# EAGLE design Modul I2C (EAGLE 9.0.1)
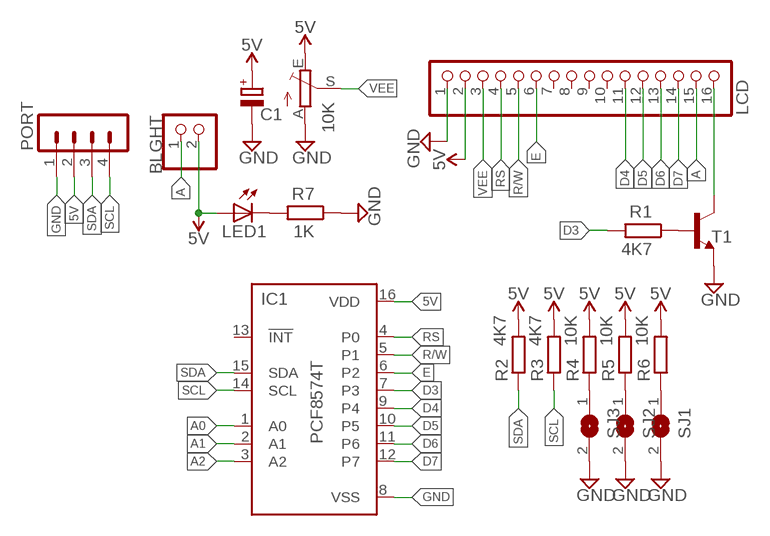
[diagram p0: schematic, sheet 1]

## Parts
10K  TRIM_EU-CT6  [CT6]
BLGHT  PINHD-1X2  [1X02]
C1  CPOL-EUE2.5-5  [E2,5-5]
IC1  PCF8574T  [SO16W]
LCD  PINHD-1X16  [1X16]
LED1  LED3MM  [LED3MM]
PORT  MA04-1  [MA04-1]
R1  4K7  R-EU_R0805  [R0805]
R2  4K7  R-EU_R0805  [R0805]
R3  4K7  R-EU_R0805  [R0805]
R4  10K  R-EU_R0805  [R0805]
R5  10K  R-EU_R0805  [R0805]
R6  10K  R-EU_R0805  [R0805]
R7  1K  R-EU_R0805  [R0805]
SJ1  SJ  [SJ]
SJ2  SJ  [SJ]
SJ3  SJ  [SJ]
T1  MMBT918LT1-NPN-SOT23-BEC  [SOT23-BEC]

## Nets
5V: 10K.E BLGHT.2 C1.+ IC1.16(VDD) LCD.2 LED1.A PORT.2 R2.2 R3.2 R4.2 R5.2 R6.2
A: BLGHT.1 LCD.15
A0: IC1.1(A0)
A1: IC1.2(A1)
A2: IC1.3(A2)
D3: IC1.7(P3) R1.2
D4: IC1.9(P4) LCD.11
D5: IC1.10(P5) LCD.12
D6: IC1.11(P6) LCD.13
D7: IC1.12(P7) LCD.14
E: IC1.6(P2) LCD.6
GND: 10K.A C1.- IC1.8(VSS) LCD.1 PORT.1 R7.1 SJ1.2 SJ2.2 SJ3.2 T1.E
K: LCD.16 T1.C
N$1: R1.1 T1.B
N$2: R6.1 SJ1.1
N$3: R5.1 SJ2.1
N$4: R4.1 SJ3.1
N$6: LED1.K(C) R7.2
R/W: IC1.5(P1) LCD.5
RS: IC1.4(P0) LCD.4
SCL: IC1.14(SCL) PORT.4 R3.1
SDA: IC1.15(SDA) PORT.3 R2.1
VEE: 10K.S LCD.3
Unconnected: IC1.13(!INT) LCD.7 LCD.8 LCD.9 LCD.10

## Library data of the parts
10K = pot:TRIM_EU-: POTENTIOMETER
BLGHT = pinhead:PINHD-1X2: PIN HEADER
C1 = rcl:CPOL-EU: POLARIZED CAPACITOR, European symbol; SPICEPREFIX: C
IC1 = micro-philips:PCF8574: I2C-Bus Remote 8-bit I/O expander http://www.semiconductors.philips.com/acrobat_download/datasheets/PCF8574_4.pdf; MPN: PCF8574T/3,512; OC_FARNELL: 1201255; OC_NEWARK: 70R6870
LCD = pinhead:PINHD-1X16: PIN HEADER
LED1 = adafruit:LED: LED OSRAM: - CHIPLED LG R971, LG N971, LY N971, LG Q971, LY Q971, LO R971, LY R971 LH N974, LH R974 LS Q976, LO Q976, LY Q976 LO Q996 - Hyper CHIPLED LW Q18S LB Q993, LB Q99A, LB R99A - SideLED LS A670, LO A670, LY A670, LG A670, LP A670 LB A673, LV A673, LT A673, LW A673 LH A674 LY A675 LS A676, LA A676, LO A676, LY A676, LW A676 LS A679, LY A679, LG A679 - Hyper Micro SIDELED® LS Y876, LA Y876, LO Y876, LY Y876 LT Y87S - SmartLED LW L88C, LW L88S LB L89C, LB L89S, LG L890 LS L89K, LO L89K, LY L89K LS L896, LA L896, LO L896, LY L896 - TOPLED LS T670, LO T670, LY T670, LG T670, LP T670 LSG T670, LSP T670, LSY T670, LOP T670, LYG T670 LG T671, LOG T671, LSG T671 LB T673, LV T673, LT T673, LW T673 LH T674 LS T676, LA T676, LO T676, LY T676, LB T676, LH T676, LSB T676, LW T676 LB T67C, LV T67C, LT T67C, LS T67K, LO T67K, LY T67K, LW E67C LS E67B, LA E67B, LO E67B, LY E67B, LB E67C, LV E67C, LT E67C LW T67C LS T679, LY T679, LG T679 LS T770, LO T770, LY T770, LG T770, LP T770 LB T773, LV T773, LT T773, LW T773 LH T774 LS E675, LA E675, LY E675, LS T675 LS T776, LA T776, LO T776, LY T776, LB T776 LHGB T686 LT T68C, LB T68C - Hyper Mini TOPLED® LB M676 - Mini TOPLED Santana® LG M470 LS M47K, LO M47K, LY M47K Source: http://www.osram.convergy.de/
PORT = con-lstb:MA04-1: PIN HEADER; OC_FARNELL: unknown; OC_NEWARK: unknown
R1-R7 = rcl:R-EU_: RESISTOR, European symbol; SPICEPREFIX: R
SJ1-SJ3 = jumper:SJ: SMD solder JUMPER
T1 = transistor:*-NPN-: NPN Transistror BF959 corrected 2008.03.06

## Board
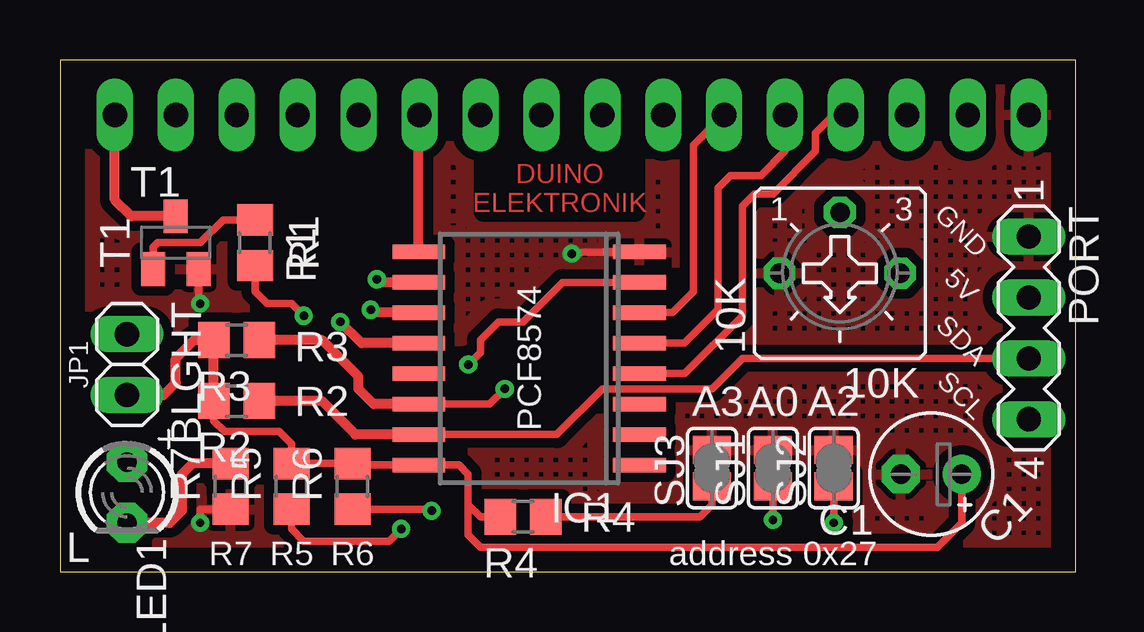
[diagram p1: board, top side]
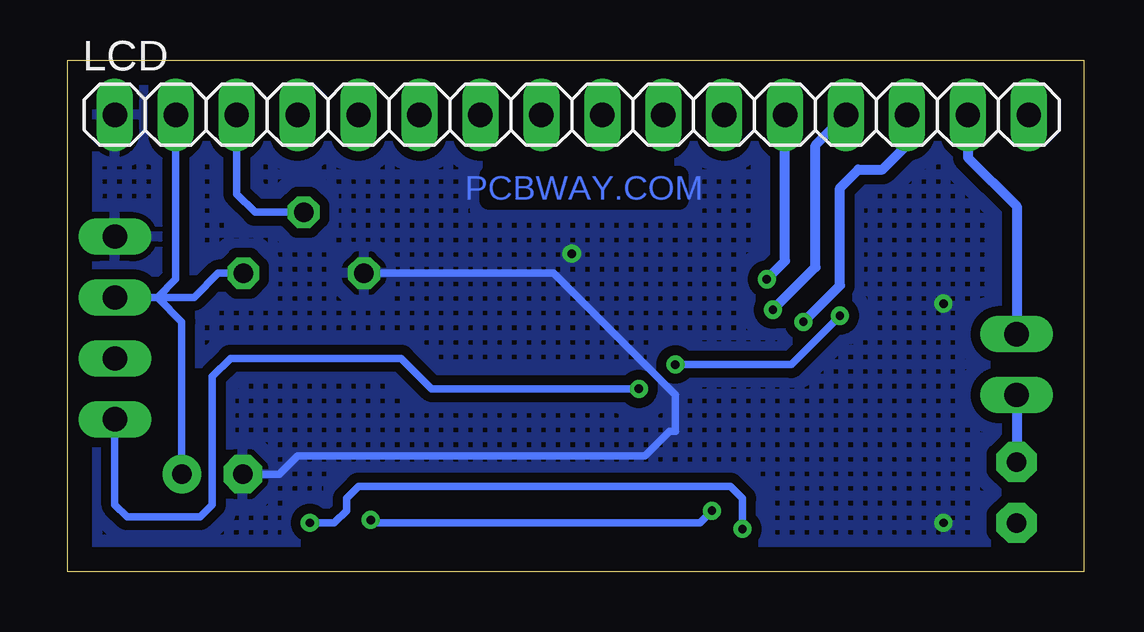
[diagram p2: board, bottom side, seen from below]

Size 42.34 x 21.33 mm. Coordinates in mm from the lower left corner, seen from the top.
Outline: 0,0 42.34,0 42.34,21.33 0,21.33 0,0
Copper layers (1*16): Top 0.035mm / dielectric 1.5mm / Bottom 0.035mm
Design rules "default": minimum track width 6mil, minimum drill 0.35mm, track to track 6mil, track to pad 6mil, pad to pad 6mil, via to via 6mil, smd to smd 6mil, copper to edge 40mil, drill to drill 6mil, minimum pad ring 10mil, minimum via ring 8mil, stop-mask expansion 4mil, vias tented up to drill 0mil, thermal gap 10mil

### Footprints (pad centres in the part's own frame; a part is rotated, then mirrored left to right if it is on the bottom)
CT6 = drill 0.813 octagon: A 2.515,0; E -2.515,0; S 0,-2.54
1X02 = drill 1.016 long: 1 -1.27,0; 2 1.27,0
E2,5-5 = drill 0.813 pad 1.6: + -1.27,0 | drill 0.813 pad 1.6 octagon: - 1.27,0
SO16W = smd 0.6 x 2.2: 1 -4.445,-4.6; 2 -3.175,-4.6; 3 -1.905,-4.6; 4 -0.635,-4.6; 5 0.635,-4.6; 6 1.905,-4.6; 7 3.175,-4.6; 8 4.445,-4.6; 9 4.445,4.6; 10 3.175,4.6; 11 1.905,4.6; 12 0.635,4.6; 13 -0.635,4.6; 14 -1.905,4.6; 15 -3.175,4.6; 16 -4.445,4.6
1X16 = drill 1.016 long: 1 -19.05,0; 2 -16.51,0; 3 -13.97,0; 4 -11.43,0; 5 -8.89,0; 6 -6.35,0; 7 -3.81,0; 8 -1.27,0; 9 1.27,0; 10 3.81,0; 11 6.35,0; 12 8.89,0; 13 11.43,0; 14 13.97,0; 15 16.51,0; 16 19.05,0
LED3MM = drill 0.813 pad 1.676 octagon: A -1.27,0; K 1.27,0
MA04-1 = drill 1.016 long: 1 -3.81,0; 2 -1.27,0; 3 1.27,0; 4 3.81,0
R0805 = smd 1.3 x 1.5: 1 -0.95,0; 2 0.95,0
SJ = smd 1.168 x 1.6: 1 -0.762,0; 2 0.762,0
SOT23-BEC = smd 1 x 1.4: B -0.95,-1.1; C 0,1.1; E 0.95,-1.1

### Placement (x,y rotation side)
10K  32.51,12.45 180 top
BLGHT  2.79,8.64 270 top
C1  36.32,4.06 180 top
IC1  19.56,8.89 90 top
LCD  21.34,19.05 0 bottom
LED1  2.79,3.3 270 top
PORT  40.39,10.16 270 top
R1  8.13,13.72 270 top
R2  7.37,7.11 180 top
R3  7.37,9.65 180 top
R4  19.3,2.29 180 top
R5  9.65,3.56 90 top
R6  12.19,3.56 90 top
R7  7.11,3.56 90 top
SJ1  29.72,4.32 90 top
SJ2  32.26,4.32 90 top
SJ3  27.18,4.32 90 top
T1  4.83,13.72 0 top

### Tracks (layer width: path | path; a pad name or v marks a point on that pad's centre or on a via)
5V
  Top 0.305: R2.2 6.42,6.28 6.86,5.84 9.14,5.84 9.65,5.33 R5.2 R6.2 12.25,4.45 IC1.16 16.64,4.45 17.02,4.06 17.02,2.79 | 17.02,2.79 17.53,2.29 R4.2 | C1.+ 37.59,2.03 36.58,1.02 17.53,1.02 17.02,1.52 17.02,2.79
  Top 0.406: R2.2 R3.2 5.59,9.65 4.83,8.89 4.83,7.87 4.32,7.37 BLGHT.2
  Bottom 0.305: LCD.2 37.85,12.19 38.61,11.43 | 38.61,11.43 PORT.2 | 10K.E 36.07,12.45 37.08,11.43 38.61,11.43 | C1.+ 37.59,10.41 38.61,11.43
  Bottom 0.406: BLGHT.2 LED1.A
A
  Bottom 0.406: LCD.15 4.83,17.27 2.79,15.24 BLGHT.1
D3  (via drill 0.35)
  Top 0.305: R1.2 8.13,11.68 8.64,11.18 9.65,11.18 v10.16,10.67 | v17.02,8.64 17.53,9.14 17.53,9.65 18.29,10.41 19.3,10.41 20.95,12.06 IC1.7
  Bottom 0.305: v17.02,8.64 12.19,8.64 v10.16,10.67
D4
  Top 0.406: IC1.9 14.96,19.02 LCD.11
D5  (via drill 0.35)
  Top 0.406: IC1.10 13.33,12.06 v13.21,12.19
  Bottom 0.406: v13.21,12.19 12.45,12.95 LCD.12
D6  (via drill 0.35)
  Top 0.406: IC1.11 13.08,10.8 v12.95,10.92
  Bottom 0.406: v12.95,10.92 11.18,12.7 11.18,17.78 LCD.13
D7  (via drill 0.35)
  Top 0.406: IC1.12 12.57,9.52 v11.68,10.41
  Bottom 0.406: v11.68,10.41 10.16,11.94 10.16,16 9.4,16.76 8.38,16.76 7.37,17.78 LCD.14
E
  Top 0.305: IC1.6 25.53,10.8 26.42,11.68 26.42,17.78 LCD.6
GND  (via drill 0.35)
  Top 0.305: R7.1 5.84,2.61 v5.84,2.03 | T1.E 5.78,11.24 v5.84,11.18 | IC1.8 21.92,13.33 v21.34,13.26
  Bottom 0.305: 10K.A 22.1,12.45 17.02,7.37 17.02,5.84 17.27,5.84 18.29,4.83 32.77,4.83 33.53,4.06 C1.- | v21.34,13.26 21.34,13.21
  pour Bottom (isolate 0.406, hatched): 0,21.34 42.42,21.34 42.42,0 0,0
  pour Top (isolate 0.406, hatched): 0,21.34 42.42,21.34 42.42,0 0,0
K
  Top 0.406: T1.C 2.96,14.82 2.29,15.49 LCD.16
N$1
  Top 0.305: T1.B 3.88,13.53 4.06,13.72 5.84,13.72 6.79,14.67 R1.1
N$2  (via drill 0.35)
  Top 0.305: R6.1 15.43,2.61 v15.49,2.54 | v29.72,2.16 SJ1.1
  Bottom 0.305: v15.49,2.54 16,2.03 18.29,2.03 29.59,2.03 v29.72,2.16
N$3  (via drill 0.35)
  Top 0.305: R5.1 9.65,1.78 10.16,1.27 13.72,1.27 v14.22,1.78 | v32.26,2.03 SJ2.1
  Bottom 0.305: v14.22,1.78 14.22,3.05 14.73,3.56 30.23,3.56 30.73,3.05 30.73,2.54 31.24,2.03 v32.26,2.03
N$4
  Top 0.305: R4.1 26.67,2.29 27.18,2.79 SJ3.1
N$6
  Top 0.406: R7.2 5.52,4.51 5.08,4.06 5.08,2.54 4.57,2.03 LED1.K
R/W
  Top 0.305: IC1.5 26.03,9.52 27.43,10.92 27.43,16 27.94,16.51 29.21,16.51 30.23,17.53 LCD.5
RS
  Top 0.305: LCD.4 32.26,19.05 31.5,18.29 31.5,17.53 29.72,15.75 28.96,15.75 28.45,15.24 28.45,10.67 26.03,8.25 IC1.4
SCL  (via drill 0.35)
  Top 0.305: IC1.14 17.91,6.98 v18.54,7.62
  Top 0.406: 8.64,9.65 R3.1 10.92,9.65 12.45,8.13 12.45,7.62 13.08,6.98 IC1.14
  Bottom 0.305: v18.54,7.62 27.18,7.62 28.45,8.89 35.56,8.89 36.32,8.13 36.32,2.79 36.83,2.29 39.88,2.29 40.39,2.79 PORT.4
SDA
  Top 0.305: PORT.3 28.45,8.89 27.18,7.62 22.61,7.62 20.7,5.72 IC1.15
  Top 0.406: IC1.15 12.32,5.72 10.92,7.11 R2.1
VEE
  Bottom 0.305: LCD.3 35.31,15.75 34.54,14.99 10K.S

### Text on the board
Top: DUINO / ELEKTRONIK
Bottom: PCBWAY.COM
tPlace: GND | T1 | R1 | 5V | 10K | R3 | SDA | JP1 | PCF8574 | R2 | A3 | A0 | A2 | SCL | R4 | C1 | L | R7 | R5 | R6 | address 0x27
tStop: DUINO / ELEKTRONIK
bStop: PCBWAY.COM